# EAGLE design indoor_servo_module (EAGLE 9.6.2)
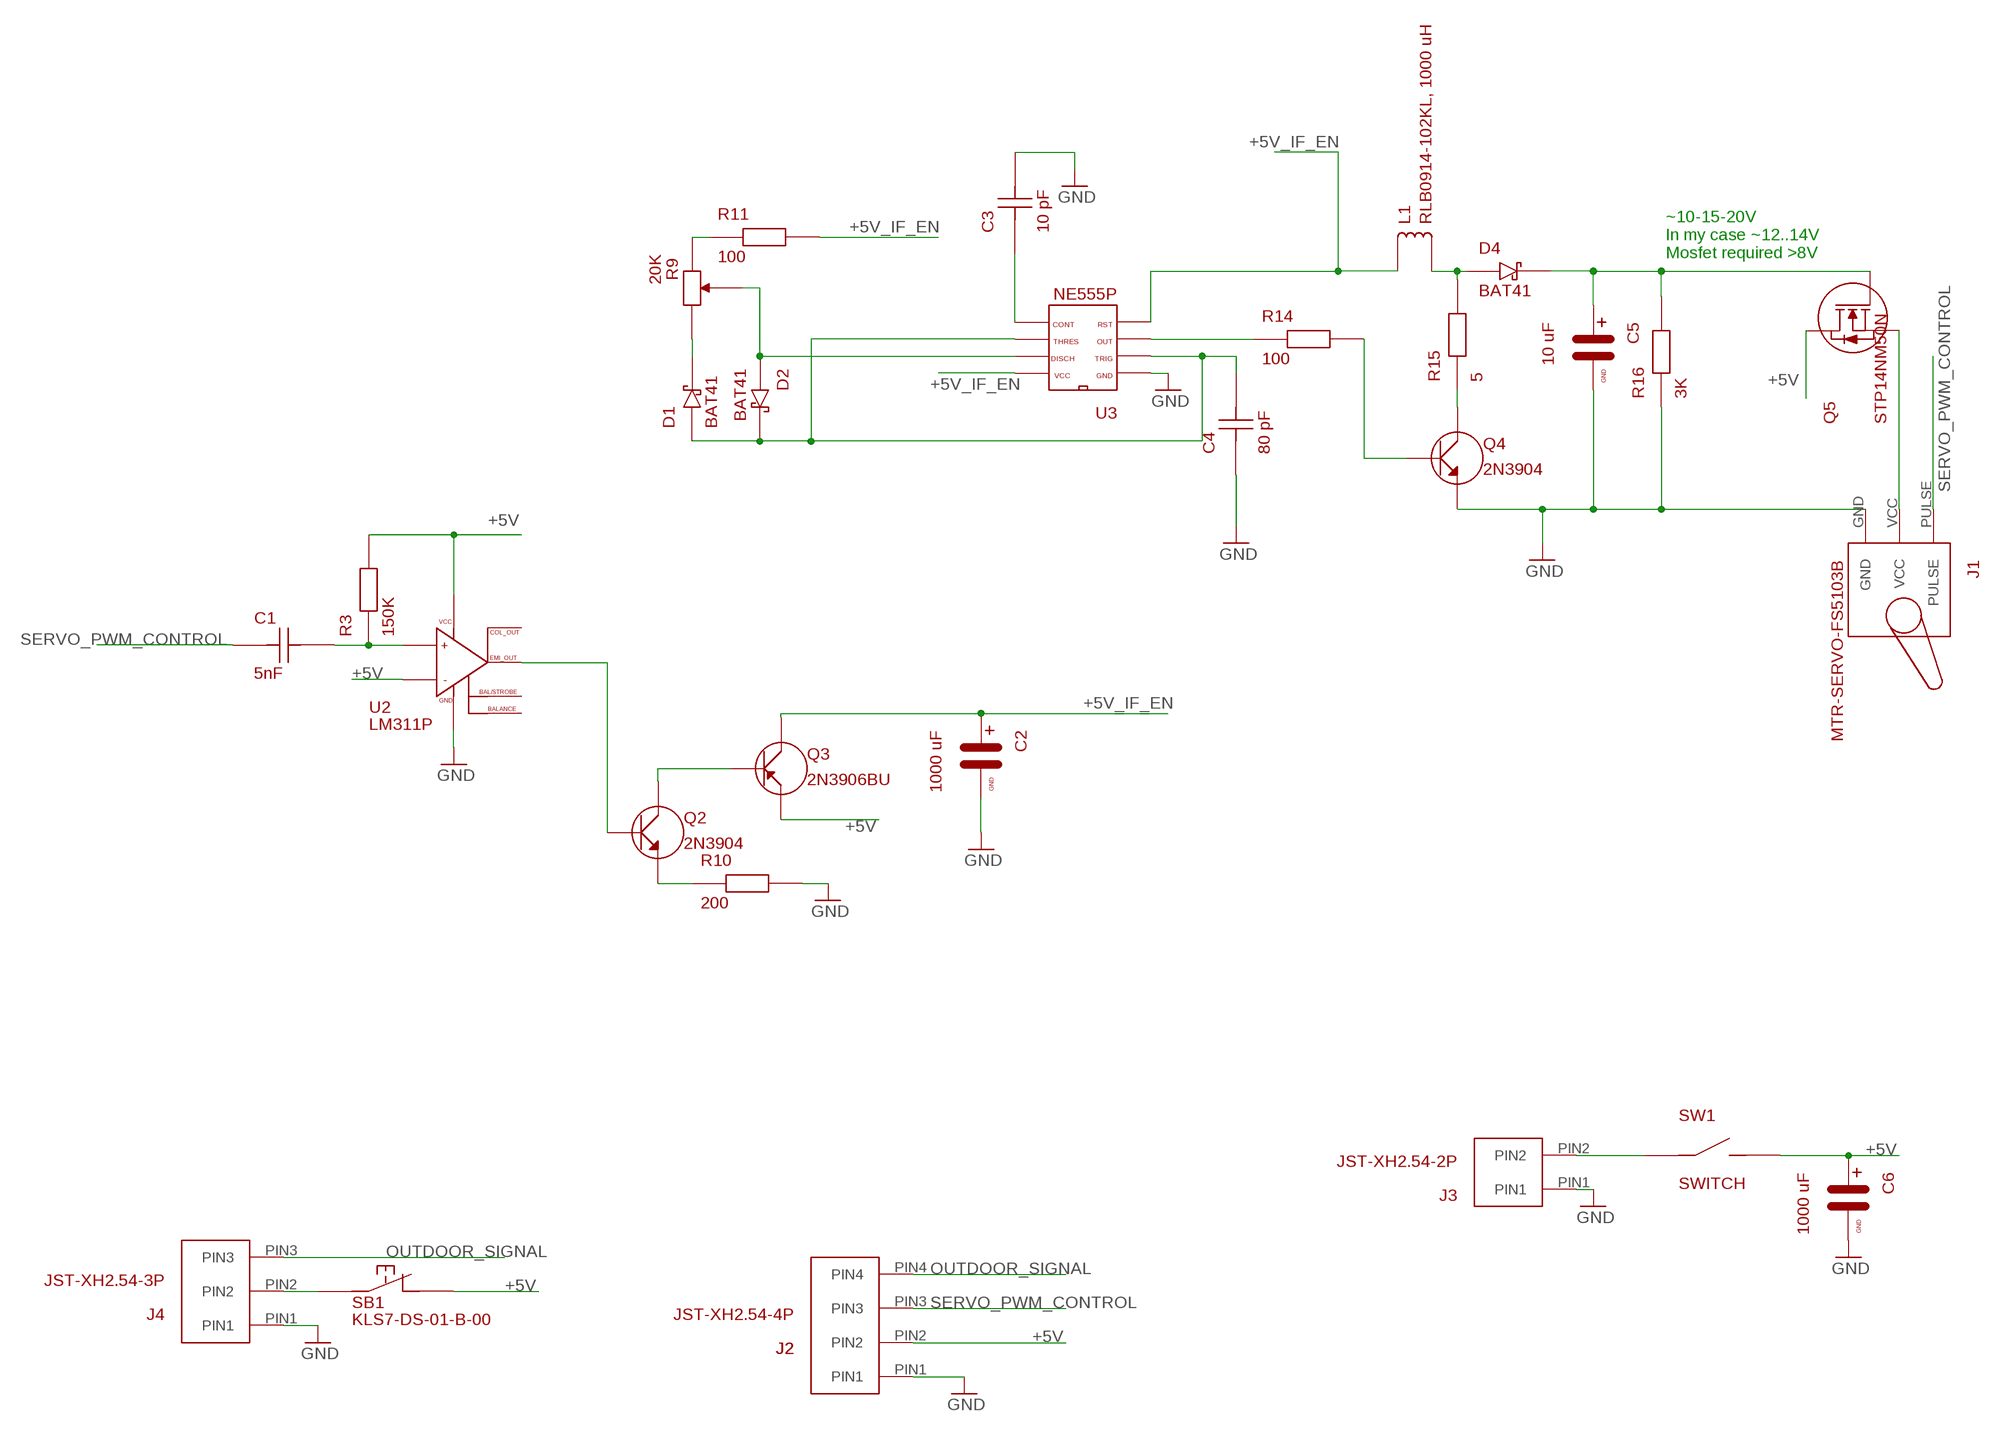
[diagram p0: schematic, sheet 1]

## Parts
C1  5nF  C-1  [C-1]
C2  1000 uF  C  [C]
C3  10 pF  C-1  [C-1]
C4  80 pF  C-1  [C-1]
C5  10 uF  C  [C]
C6  1000 uF  C  [C]
D1  BAT41  D_SCHOTTKY  [D_SCHOTTKY]
D2  BAT41  D_SCHOTTKY  [D_SCHOTTKY]
D4  BAT41  D_SCHOTTKY  [D_SCHOTTKY]
J1  MTR-SERVO-FS5103B  SERVO  [SERVO]
J2  JST-XH2.54-4P  JST-XH254-4P  [JST-XH254-4P]
J3  JST-XH2.54-2P  JST-XH254-2P  [JST-XH254-2P]
J4  JST-XH2.54-3P  JST-XH254-3P  [JST-XH254-3P]
L1  RLB0914-102KL, 1000 uH  L  [L-RLB0914]
Q2  2N3904  TRANSISTOR_NPN  [TRANSISTOR]
Q3  2N3906BU  TRANSISTOR_PNP  [TRANSISTOR]
Q4  2N3904  TRANSISTOR_NPN  [TRANSISTOR]
Q5  STP14NM50N  MOSFET_N  [MOSFET_N]
R3  150K  R  [R]
R9  20K  RD  [RD-3362H]
R10  200  R  [R]
R11  100  R  [R]
R14  100  R  [R]
R15  5  R  [R]
R16  3K  R  [R]
SB1  KLS7-DS-01-B-00  SB-NC  [SB-NC]
SW1  SWITCH  [SWITCH]
U2  LM311P  [DIP8]
U3  NE555P  [DIP8]

## Nets
+5V: C6.PIN_PLUS J2.PIN2 Q3.E Q5.D R3.P$2 SB1.P$2 SW1.P$2 U2.PIN_3(IN-) U2.PIN_8(VCC)
+5V_IF_EN: C2.PIN_PLUS L1.P$1 Q3.C R11.P$2 U3.PIN_4(RESET) U3.PIN_8(VCC)
GND: C2.PIN_GND C3.P$2 C4.P$1 C5.PIN_GND C6.PIN_GND J1.GND J2.PIN1 J3.PIN1 J4.PIN1 Q4.E R10.P$2 R16.P$1 U2.PIN_4(GND) U3.PIN_1(GND)
N$1: Q4.C R15.P$1
N$2: Q4.B R14.P$2
N$3: J3.PIN2 SW1.P$1
N$4: J4.PIN2 SB1.P$1
N$35: R14.P$1 U3.PIN_3(OUT)
N$37: Q2.C Q3.B
N$38: Q2.E R10.P$1
N$39: D4.ANODE L1.P$2 R15.P$2
N$40: J1.VCC Q5.S
N$44: C3.P$1 U3.PIN_5(CONT)
N$46: C4.P$2 D1.ANODE D2.CATHODE U3.PIN_2(TRIG) U3.PIN_6(THRES)
N$47: D2.ANODE R9.P3 U3.PIN_7(DISCH)
N$48: D1.CATHODE R9.P2
N$49: R9.P1 R11.P$1
N$50: Q2.B U2.PIN_1(EMI_OUT)
N$51: C5.PIN_PLUS D4.CATHODE Q5.G R16.P$2
N$53: C1.P$2 R3.P$1 U2.PIN_2(IN+)
OUTDOOR_SIGNAL: J2.PIN4 J4.PIN3
SERVO_PWM_CONTROL: C1.P$1 J1.PULSE J2.PIN3
Unconnected: U2.PIN_5(BALANCE) U2.PIN_6(BAL_STROBE) U2.PIN_7(COL_OUT)

## Notes on the sheet
- ~10-15-20V
  In my case ~12..14V
  Mosfet required >8V

## Library data of the parts
C1 C3 C4 = my_devices:C-1
C2 C5 C6 = my_devices:C
D1 D2 D4 = my_devices:D_SCHOTTKY
J1 = my_devices:SERVO
J2 = my_devices:JST-XH254-4P
J3 = my_devices:JST-XH254-2P
J4 = my_devices:JST-XH254-3P
L1 = my_devices:L
Q2 Q4 = my_devices:TRANSISTOR_NPN
Q3 = my_devices:TRANSISTOR_PNP
Q5 = my_devices:MOSFET_N
R3 R10 R11 R14-R16 = my_devices:R
R9 = my_devices:RD
SB1 = my_devices:SB-NC
SW1 = my_devices:SWITCH
U2 = my_devices:LM311P
U3 = my_devices:NE555P

## Board
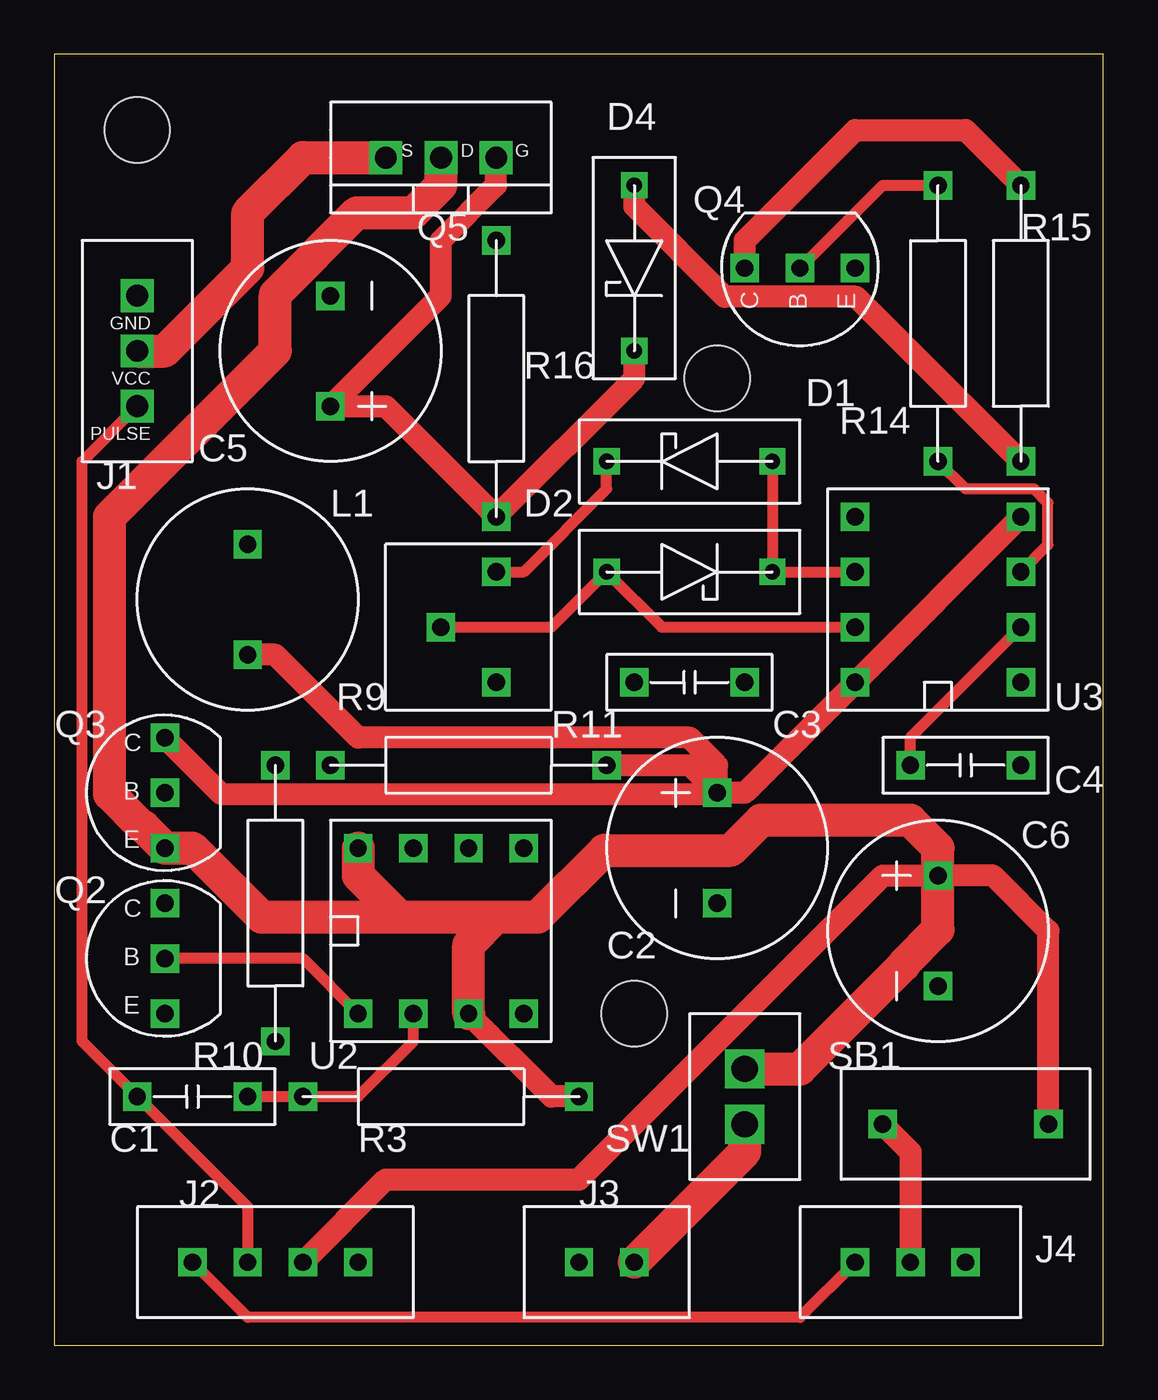
[diagram p1: board, top side]
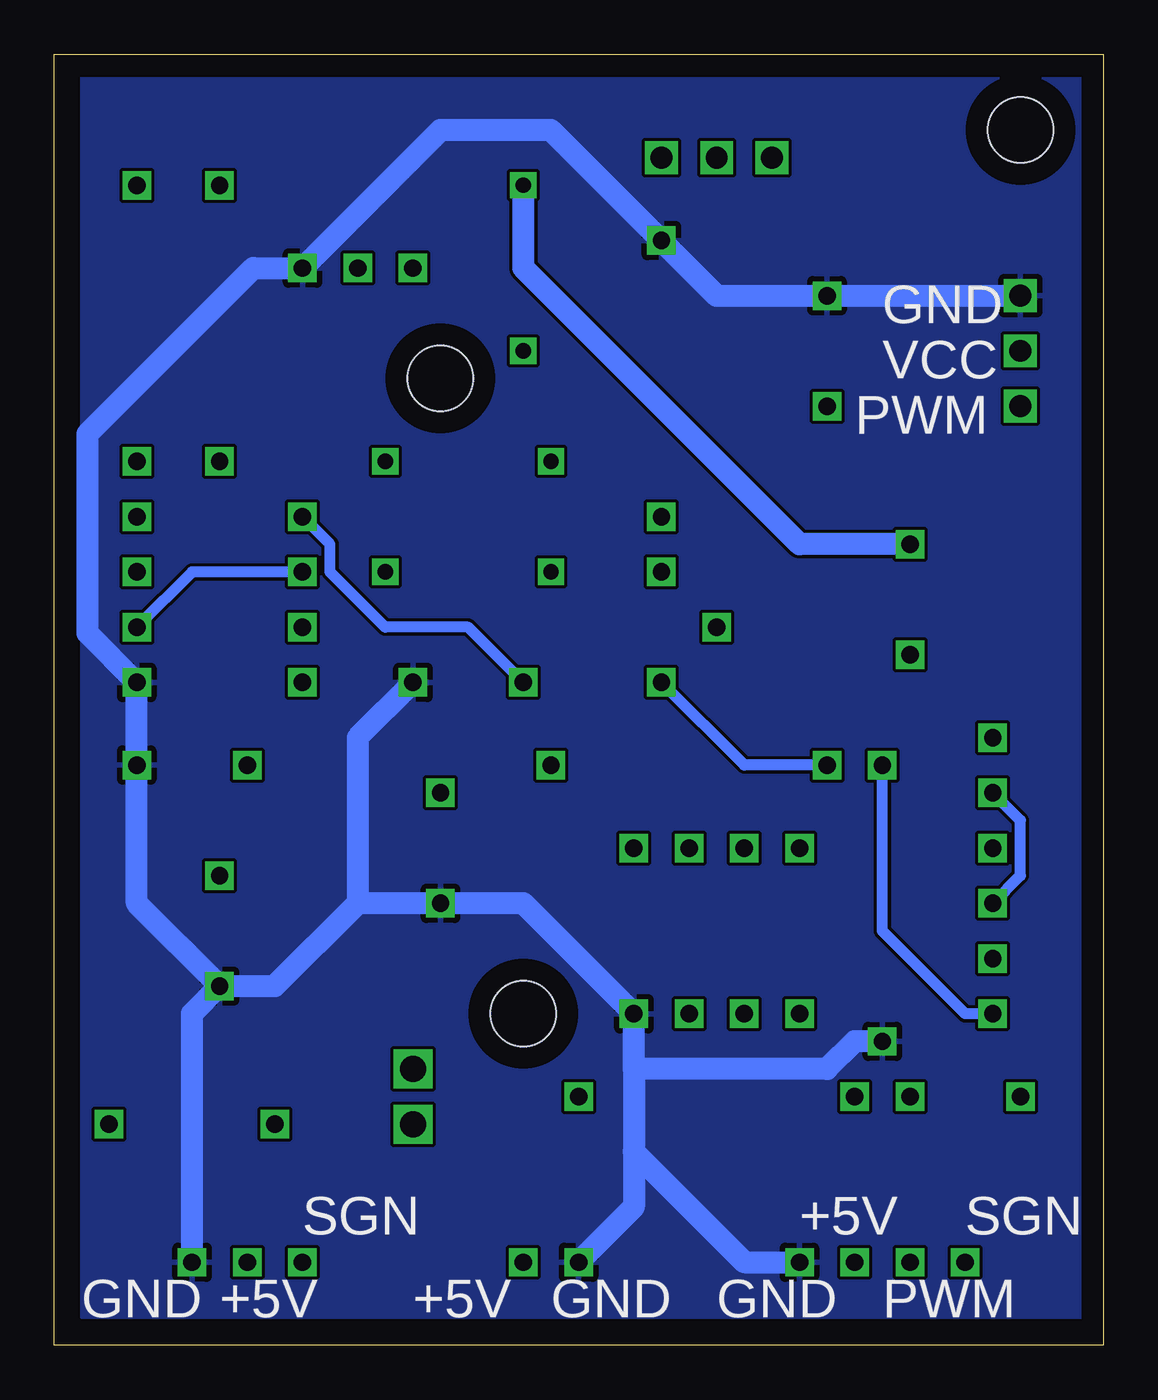
[diagram p2: board, bottom side, seen from below]

Size 48.24 x 59.36 mm. Coordinates in mm from the lower left corner, seen from the top.
Outline: 0,0 48.24,0 48.24,59.36 0,59.36 0,0
Copper layers (1*16): Top 0.035mm / dielectric 1.5mm / Bottom 0.035mm
Design rules "default": minimum track width 6mil, minimum drill 0.35mm, track to track 6mil, track to pad 6mil, pad to pad 6mil, via to via 6mil, smd to smd 6mil, copper to edge 40mil, drill to drill 6mil, minimum pad ring 10mil, minimum via ring 8mil, stop-mask expansion 4mil, vias tented up to drill 0mil, thermal gap 10mil
Holes 3 mm at 3.81,55.88 30.48,44.45 26.67,15.24

### Footprints (pad centres in the part's own frame; a part is rotated, then mirrored left to right if it is on the bottom)
C-1 = drill 0.8 square: P$1 -2.54,0; P$2 2.54,0
C = drill 0.8 square: PIN_GND 2.54,0; PIN_PLUS -2.54,0
D_SCHOTTKY = drill 0.7 square: ANODE -3.81,0; CATHODE 3.81,0
SERVO = drill 1 square: GND 0,-2.54; PULSE 0,2.54; VCC 0,0
JST-XH254-4P = drill 0.8 square: PIN1 -3.81,0; PIN2 -1.27,0; PIN3 1.27,0; PIN4 3.81,0
JST-XH254-2P = drill 0.8 square: PIN1 -1.27,0; PIN2 1.27,0
JST-XH254-3P = drill 0.8 square: PIN1 -2.54,0; PIN2 0,0; PIN3 2.54,0
L-RLB0914 = drill 0.8 square: P$1 2.54,0; P$2 -2.54,0
TRANSISTOR = drill 0.8 square: B 1.27,1.27; C 1.27,3.81; E 1.27,-1.27
MOSFET_N = drill 1 square: D 0,0; G -2.54,0; S 2.54,0
R = drill 0.8 square: P$1 -6.35,0; P$2 6.35,0
RD-3362H = drill 0.8 square: P1 -2.54,-1.27; P2 2.54,-1.27; P3 0,1.27
SB-NC = drill 0.8 square: P$1 -3.81,0; P$2 3.81,0
SWITCH = drill 1.2 square: P$1 -1.27,0; P$2 1.27,0
DIP8 = drill 0.8 square: PIN_1 -3.81,3.81; PIN_2 -3.81,1.27; PIN_3 -3.81,-1.27; PIN_4 -3.81,-3.81; PIN_5 3.81,-3.81; PIN_6 3.81,-1.27; PIN_7 3.81,1.27; PIN_8 3.81,3.81

### Placement (x,y rotation side)
C1  6.35,11.43 0 top
C2  30.48,22.86 270 top
C3  29.21,30.48 0 top
C4  41.91,26.67 180 top
C5  12.7,45.72 90 top
C6  40.64,19.05 270 top
D1  29.21,40.64 180 top
D2  29.21,35.56 0 top
D4  26.67,49.53 270 top
J1  3.81,45.72 180 top
J2  10.16,3.81 180 top
J3  25.4,3.81 0 top
J4  39.37,3.81 180 top
L1  8.89,34.29 270 top
Q2  3.81,16.51 0 top
Q3  3.81,24.13 0 top
Q4  35.56,48.26 90 top
Q5  17.78,54.61 180 top
R3  17.78,11.43 0 top
R9  19.05,33.02 90 top
R10  10.16,20.32 270 top
R11  19.05,26.67 0 top
R14  40.64,46.99 90 top
R15  44.45,46.99 270 top
R16  20.32,44.45 270 top
SB1  41.91,10.16 0 top
SW1  31.75,11.43 90 top
U2  17.78,19.05 90 top
U3  40.64,34.29 180 top

### Tracks (layer width: path | path; a pad name or v marks a point on that pad's centre or on a via)
+5V
  Top 1.016: SB1.P$2 45.72,19.05 43.18,21.59 C6.PIN_PLUS 38.1,21.59 24.13,7.62 15.24,7.62 J2.PIN2 | R3.P$2 22.86,11.43 U2.PIN_3
  Top 1.524: SW1.P$2 34.29,12.7 39.07,17.48 39.07,17.54 40.64,19.11 C6.PIN_PLUS 40.64,22.86 39.37,24.13 32.49,24.13 31.11,22.75 25.29,22.75 22.23,19.69 20.32,19.69 | Q5.D 17.78,53.34 16.51,52.07 13.91,52.07 10.16,48.32 10.16,45.72 2.54,38.1 2.54,25.34 4.05,23.83 4.11,23.83 Q3.E 6.35,22.86 9.52,19.69 15.88,19.69 | 15.88,19.69 20.32,19.69 | U2.PIN_8 13.97,21.59 15.88,19.69 | 20.32,19.69 19.05,18.41 U2.PIN_3
+5V_IF_EN
  Top 1.016: U3.PIN_4 U3.PIN_8 31.75,25.4 C2.PIN_PLUS | R11.P$2 29.21,26.67 C2.PIN_PLUS | C2.PIN_PLUS 30.44,25.36 7.66,25.36 Q3.C | C2.PIN_PLUS 30.48,26.67 29.21,27.94 13.97,27.94 10.16,31.75 L1.P$1
GND
  Bottom 1.016: 21.59,12.7 21.59,8.89 | 21.59,12.7 U2.PIN_4 26.67,20.32 C2.PIN_GND 34.29,20.32 | R10.P$2 11.43,13.97 12.7,12.7 21.59,12.7 | J1.GND C5.PIN_GND 17.78,48.26 R16.P$1 25.4,55.88 30.48,55.88 Q4.E 39.1,49.53 46.72,41.91 46.72,32.75 U3.PIN_1 C4.P$1 44.45,20.32 C6.PIN_GND | C3.P$2 34.29,27.94 34.29,20.32 | 21.59,8.89 16.51,3.81 J2.PIN1 | 21.59,8.89 21.59,6.35 J3.PIN1 | J4.PIN1 41.91,15.24 C6.PIN_GND | C6.PIN_GND 38.1,16.51 34.29,20.32
  pour Bottom: 0,58.42 46.99,58.42 46.99,1.27 0,1.27
N$1
  Top 1.016: Q4.C 31.75,50.8 36.83,55.88 41.91,55.88 R15.P$1
N$2
  Top 0.508: Q4.B 38.1,53.34 R14.P$2
N$3
  Top 1.524: J3.PIN2 31.75,8.89 SW1.P$1
N$4
  Top 1.016: SB1.P$1 39.37,8.89 J4.PIN2
N$35
  Top 0.508: U3.PIN_3 45.7,36.81 45.7,38.73 45.06,39.37 41.91,39.37 R14.P$1
N$37
  Bottom 0.508: Q2.C 3.81,21.59 3.81,24.13 Q3.B
N$38
  Bottom 0.508: Q2.E 6.35,15.24 10.16,19.05 R10.P$1
N$39
  Top 1.016: R15.P$2 36.87,48.22 30.82,48.22 26.67,52.37 D4.ANODE
  Bottom 1.016: L1.P$2 13.97,36.83 26.67,49.53 D4.ANODE
N$40
  Top 1.524: J1.VCC 5.08,45.72 8.89,49.53 8.89,52.07 11.43,54.61 Q5.S
N$44
  Bottom 0.508: C3.P$1 29.21,33.02 33.02,33.02 35.56,35.56 35.56,36.83 U3.PIN_5
N$46
  Top 0.508: C4.P$2 39.37,27.94 U3.PIN_2 | D1.ANODE D2.CATHODE U3.PIN_6
  Bottom 0.508: U3.PIN_6 41.91,35.56 U3.PIN_2
N$47
  Top 0.508: R9.P3 22.86,33.02 D2.ANODE 27.94,33.02 U3.PIN_7
N$48
  Top 0.508: R9.P2 21.59,35.56 25.4,39.37 D1.CATHODE
N$49
  Bottom 0.508: R11.P$1 16.51,26.67 R9.P1
N$50
  Top 0.508: U2.PIN_1 11.43,17.78 Q2.B
N$51
  Top 1.016: Q5.G 20.32,53.34 17.78,50.8 17.78,48.26 C5.PIN_PLUS 15.24,43.18 R16.P$2 26.67,44.45 D4.CATHODE
N$53
  Top 0.508: C1.P$2 R3.P$1 13.97,11.43 16.51,13.97 U2.PIN_2
OUTDOOR_SIGNAL
  Top 0.508: J4.PIN3 34.29,1.27 8.89,1.27 J2.PIN4
SERVO_PWM_CONTROL
  Top 0.508: J1.PULSE 1.27,40.64 1.27,13.97 C1.P$1 8.89,6.35 J2.PIN3

### Text on the board
bNames: GND | VCC | PWM | SGN | +5V | SGN | PWM | GND | GND | +5V | +5V | GND